# EAGLE design Relay(30A)_sla_12v_slc_v1.0 (EAGLE 9.1.0)
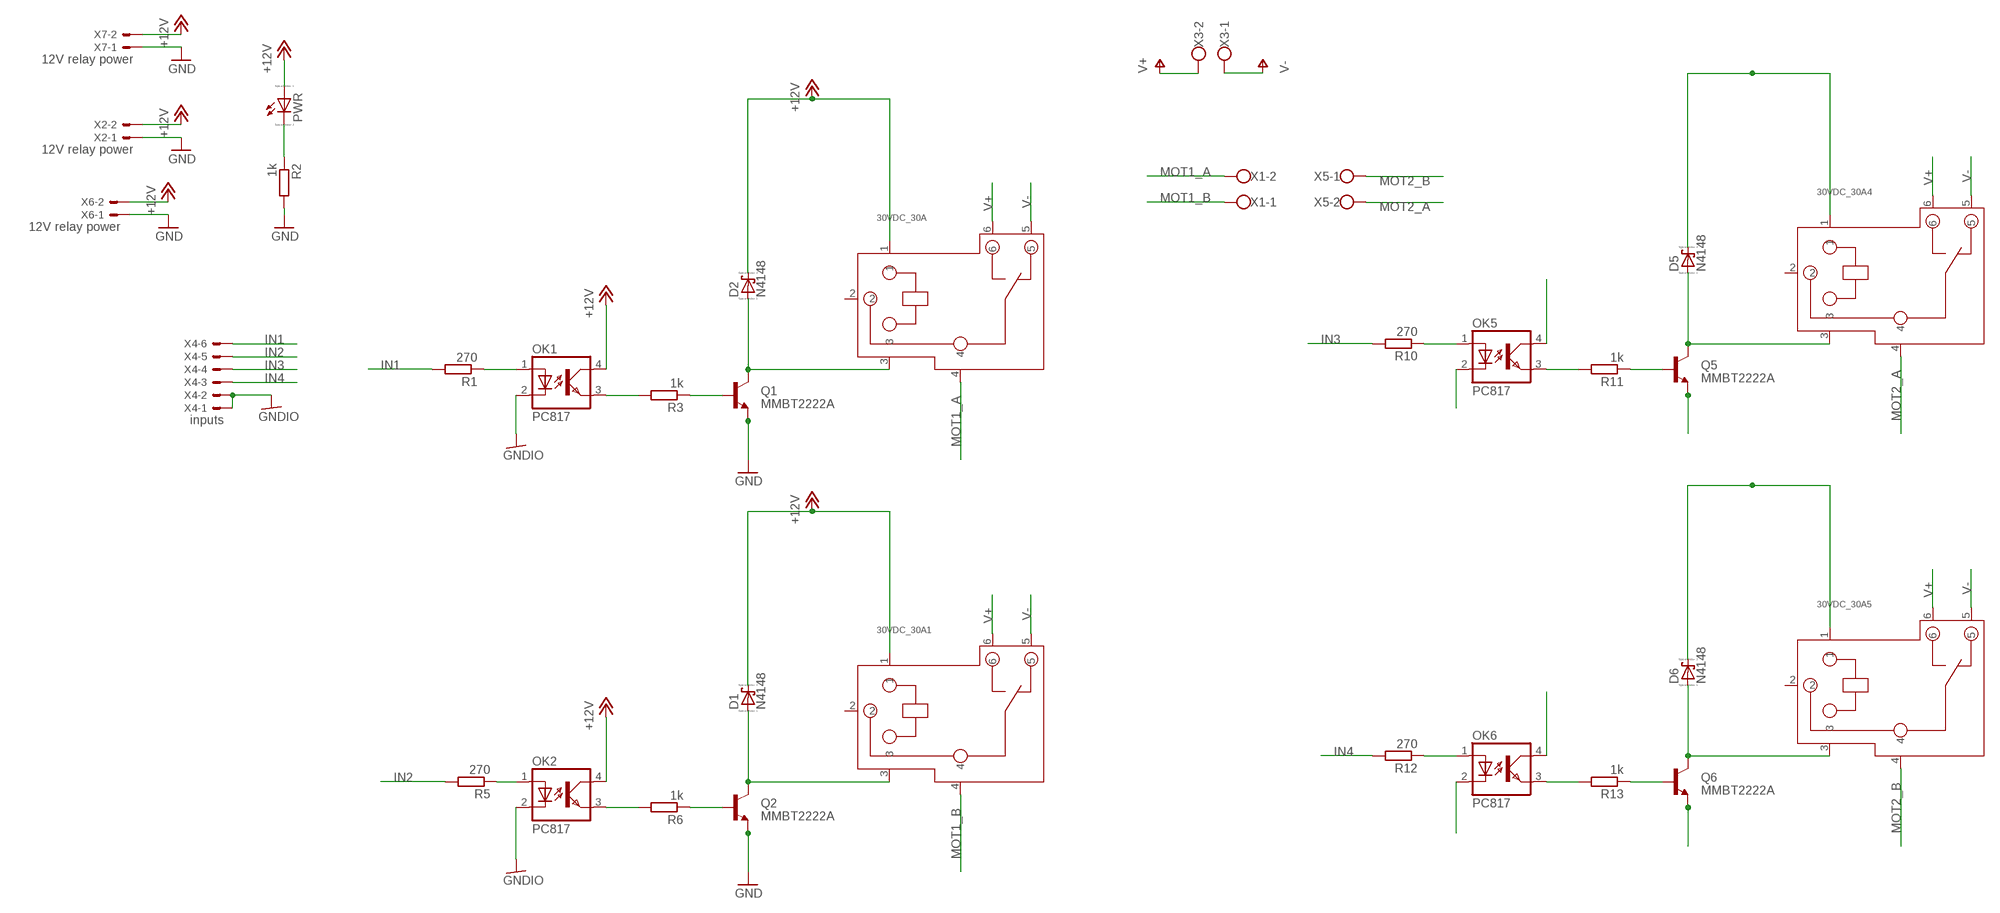
[diagram p0: schematic, sheet 1]

## Parts
30VDC_30A  RELAY-SLA-05VDC-SL-C  [6P-19.8H]
30VDC_30A1  RELAY-SLA-05VDC-SL-C  [6P-19.8H]
30VDC_30A4  RELAY-SLA-05VDC-SL-C  [6P-19.8H]
30VDC_30A5  RELAY-SLA-05VDC-SL-C  [6P-19.8H]
D1  N4148  SCHOTTKY-DIODEF126Z12  [DIODE_F126Z12]
D2  N4148  SCHOTTKY-DIODEF126Z12  [DIODE_F126Z12]
D5  N4148  SCHOTTKY-DIODEF126Z12  [DIODE_F126Z12]
D6  N4148  SCHOTTKY-DIODEF126Z12  [DIODE_F126Z12]
OK1  PC817  [DIL04]
OK2  PC817  [DIL04]
OK5  PC817  [DIL04]
OK6  PC817  [DIL04]
PWR  LED_ELD260  [LED_LD260]
Q1  MMBT2222A  TRANSISTOR_NPNTO92  [TO-92]
Q2  MMBT2222A  TRANSISTOR_NPNTO92  [TO-92]
Q5  MMBT2222A  TRANSISTOR_NPNTO92  [TO-92]
Q6  MMBT2222A  TRANSISTOR_NPNTO92  [TO-92]
R1  270  R-EU_0204/7  [0204/7]
R2  1k  R-EU_0204/5  [0204/5]
R3  1k  R-EU_0204/7  [0204/7]
R5  270  R-EU_0204/5  [0204/5]
R6  1k  R-EU_0204/7  [0204/7]
R10  270  R-EU_0207/10  [0207/10]
R11  1k  R-EU_0204/7  [0204/7]
R12  270  R-EU_0204/5  [0204/5]
R13  1k  R-EU_0204/7  [0204/7]
X1  W237-102  [W237-102]
X2  12V relay power  JST-XH-02-PIN-LONG-PAD  [JST-XH-02-PACKAGE-LONG-PAD]
X3  W237-102  [W237-102]
X4  inputs  JST-XH-06-PIN-LONG-PAD  [JST-XH-06-PACKAGE-LONG-PAD]
X5  W237-102  [W237-102]
X6  12V relay power  JST-XH-02-PIN-LONG-PAD  [JST-XH-02-PACKAGE-LONG-PAD]
X7  12V relay power  JST-XH-02-PIN-LONG-PAD  [JST-XH-02-PACKAGE-LONG-PAD]

## Nets
+12V [500mAmp]: 30VDC_30A1.1 30VDC_30A4.1 30VDC_30A5.1 30VDC_30A.1 D1.C(A) D2.C(A) D5.C(A) D6.C(A) OK1.4(COL) OK2.4(COL) OK5.4(COL) OK6.4(COL) PWR.A X2.2 X6.2 X7.2
GND: Q1.1(E) Q2.1(E) Q5.1(E) Q6.1(E) R2.2 X2.1 X6.1 X7.1
GNDIO: OK1.2(C) OK2.2(C) OK5.2(C) OK6.2(C) X4.1 X4.2
IN1: R1.2 X4.6
IN2: R5.2 X4.5
IN3: R10.2 X4.4
IN4: R12.2 X4.3
MOT1_A [30Amp]: 30VDC_30A.4 X1.2
MOT1_B [30Amp]: 30VDC_30A1.4 X1.1
MOT2_A: 30VDC_30A4.4 X5.2
MOT2_B: 30VDC_30A5.4 X5.1
N$19: OK1.3(EMIT) R3.2
N$20 [500mAmp]: 30VDC_30A1.3 D1.A(C) Q2.3(C)
N$21: PWR.K(C) R2.1
N$22: OK2.3(EMIT) R6.2
N$23 [500mAmp]: 30VDC_30A.3 D2.A(C) Q1.3(C)
N$24: Q1.2(B) R3.1
N$26: Q2.2(B) R6.1
N$27: OK2.1(A) R5.1
N$68: OK1.1(A) R1.1
N$89 [500mAmp]: 30VDC_30A4.3 D5.A(C) Q5.3(C)
N$90 [500mAmp]: 30VDC_30A5.3 D6.A(C) Q6.3(C)
N$91: OK6.1(A) R12.1
N$92: OK5.1(A) R10.1
N$93: OK5.3(EMIT) R11.2
N$94: Q5.2(B) R11.1
N$95: OK6.3(EMIT) R13.2
N$96: Q6.2(B) R13.1
V+ [30Amp]: 30VDC_30A1.6 30VDC_30A4.6 30VDC_30A5.6 30VDC_30A.6 X3.2
V- [30Amp]: 30VDC_30A1.5 30VDC_30A4.5 30VDC_30A5.5 30VDC_30A.5 X3.1
Unconnected: 30VDC_30A1.2 30VDC_30A4.2 30VDC_30A5.2 30VDC_30A.2

## Library data of the parts
30VDC_30A 30VDC_30A1 30VDC_30A4 30VDC_30A5 = Relay(30A)_sla_12v_slc_v1.0:RELAY-SLA-05VDC-SL-C: · Up to 30A switching in SPST and 20A switching in spot arrangements. · Available as an open-frame relay, with a snap-on dust cover or with an immersion cleanable, plastic sealed case.
D1 D2 D5 D6 = Relay(30A)_sla_12v_slc_v1.0:SCHOTTKY-DIODE: Schottky Diode; SPICEMODEL: NONE; SPICEPREFIX: D; SPICETYPE: diode
OK1 OK2 OK5 OK6 = Relay(30A)_sla_12v_slc_v1.0:PC817: SHARP OPTO COUPLER; MPN: PC817X4J000F; OC_FARNELL: 9707727; OC_NEWARK: 97K7059
PWR = Relay(30A)_sla_12v_slc_v1.0:LED_E: LED Source: http://www.osram.convergy.de Source: www.luxeon.com Source: www.kingbright.com; SPICEMODEL: NONE; SPICEPREFIX: D; SPICETYPE: diode
Q1 Q2 Q5 Q6 = Relay(30A)_sla_12v_slc_v1.0:TRANSISTOR_NPN: Generic NPN BJT MMBT2222A - TRANS-08049 (SOT-23, 1A 40V) MPSA42 - TRANS-09116 (SOT-23, 500mA 300V) MMBT5088LT1G - TRANS-11160 (SOT-23, 50 mA 30V) BC547 - COM-08928 <http://www.sparkfun.com/products/8928> (TO-92 45V 100mA) (1.Collector 2.Base 3.Emitter) 2N3904 - COM-00521 <http://www.sparkfun.com/products/521> (TO-92 40V 200mA) (1.Emitter 2.Base 3.Collector) P2N2222A - COM-12852 <http://www.sparkfun.com/products/12852> (TO-92 40V 600mA) (1.Collector 2.Base 3.Emitter)
R1-R3 R5 R6 R10-R13 = Relay(30A)_sla_12v_slc_v1.0:R-EU_: RESISTOR, European symbol; SPICEPREFIX: R
X1 X3 X5 = Relay(30A)_sla_12v_slc_v1.0:W237-102: WAGO SCREW CLAMP; MPN: 237-102; OC_FARNELL: unknown; OC_NEWARK: 70K9898
X2 X6 X7 = Relay(30A)_sla_12v_slc_v1.0:JST-XH-02-PIN: JST XH Connector 2 Pin Wire to board connector. Pitch: 2,54 mm, (0.100") Number of pins: 2 Created by Rembrandt Electronics www.rembrandtelectronics.com
X4 = Relay(30A)_sla_12v_slc_v1.0:JST-XH-06-PIN: JST XH Connector 2 Pin Wire to board connector. Pitch: 2,54 mm, (0.100") Number of pins: 6 Created by Rembrandt Electronics www.rembrandtelectronics.com

## Net classes
0 default: width 0.635 mm
1 30Amp: width 2.54 mm
2 500mAmp: width 0.762 mm

## Board
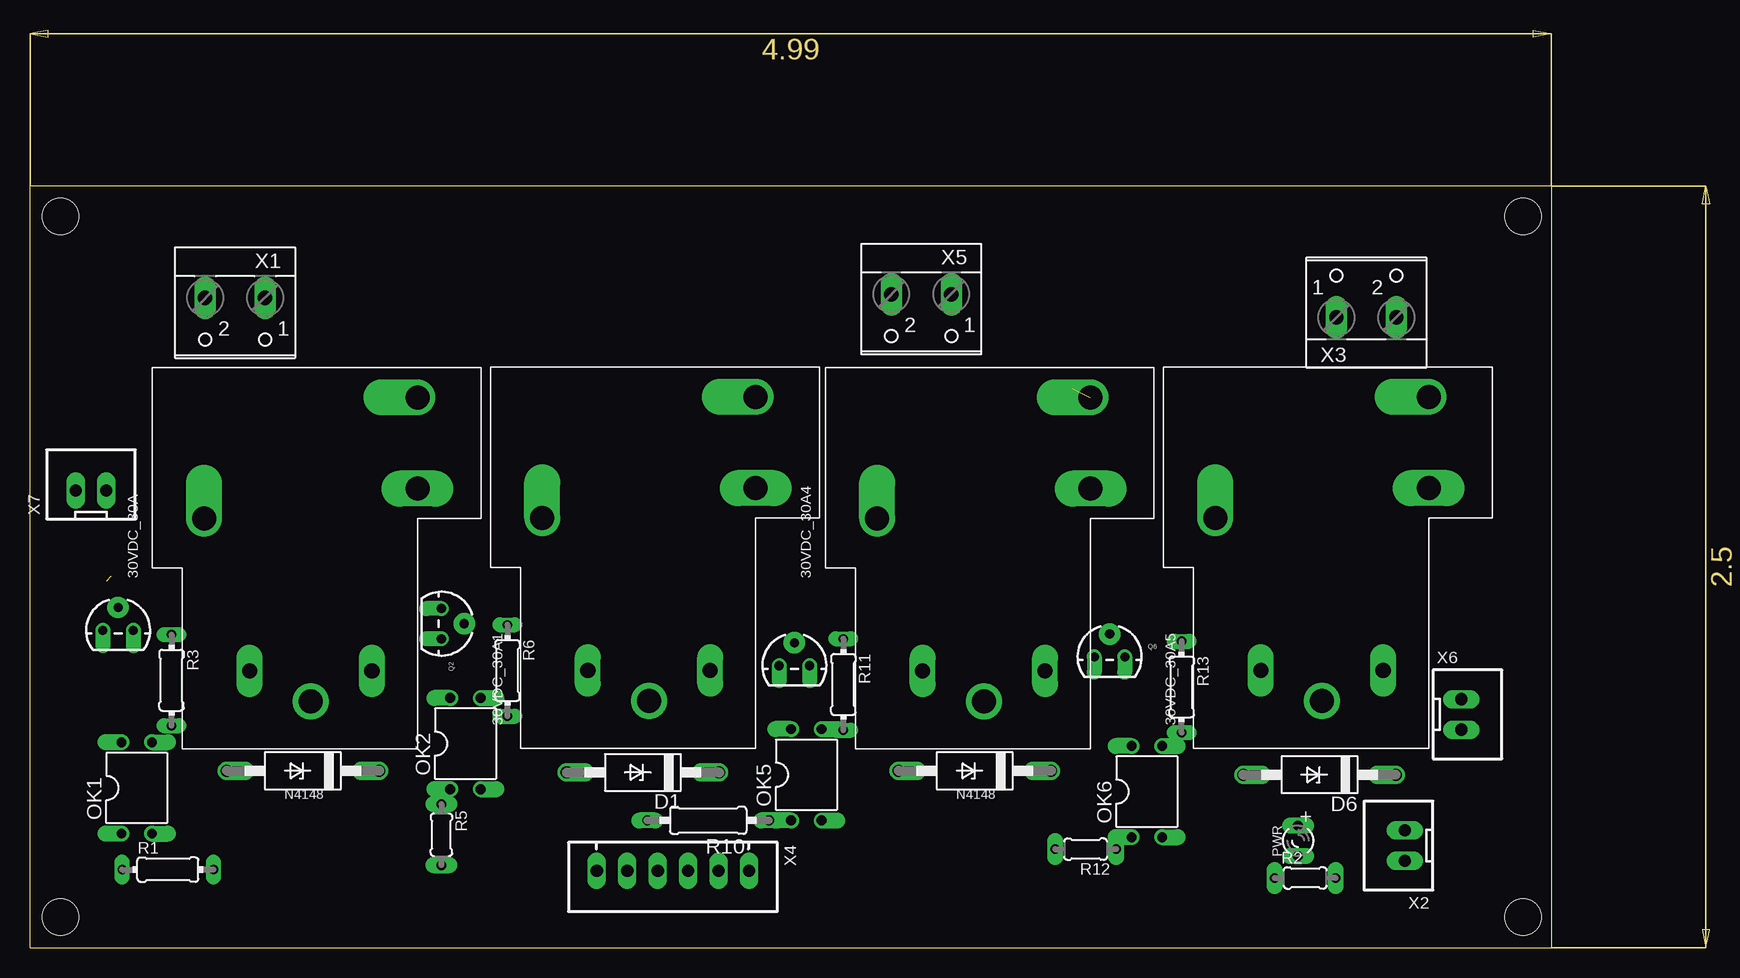
[diagram p1: board, top side]
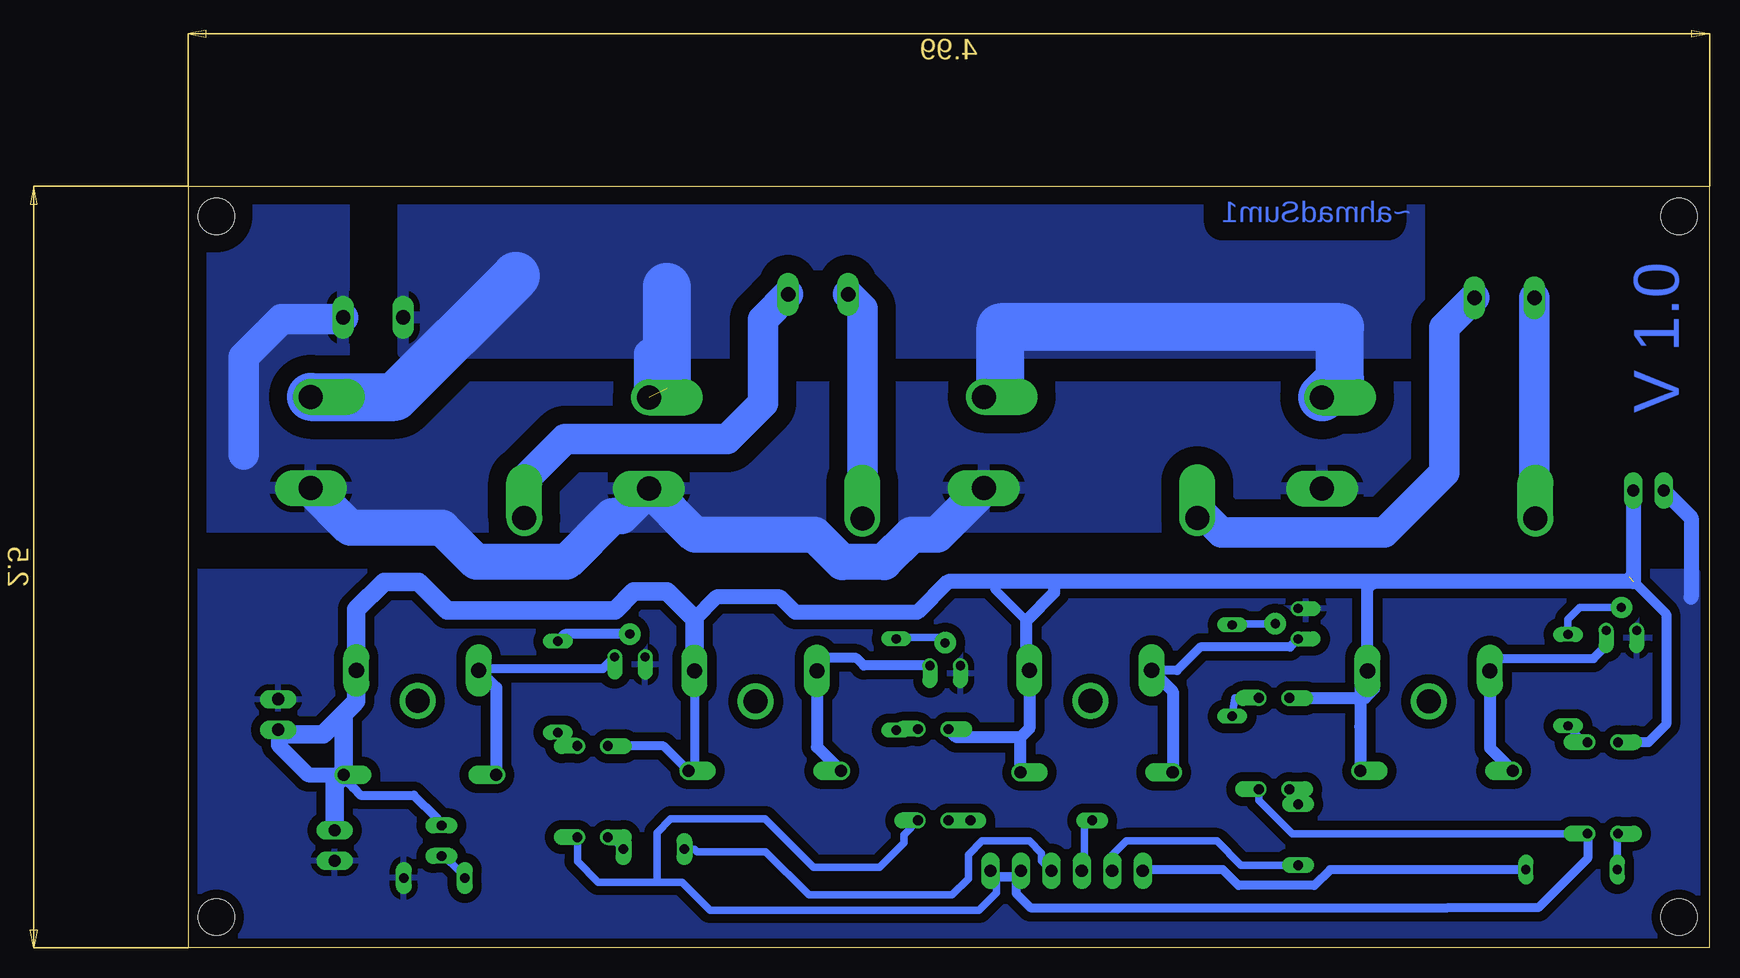
[diagram p2: board, bottom side, seen from below]

Size 126.82 x 63.5 mm. Coordinates in mm from the lower left corner, seen from the top.
Outline: 0,0 126.82,0 126.82,63.5 0,63.5 0,0
Copper layers (1*16): Top 0.035mm / dielectric 1.5mm / Bottom 0.035mm
Design rules "default_25th": minimum track width 25mil, minimum drill 30mil, track to track 25mil, track to pad 25mil, pad to pad 25mil, via to via 25mil, smd to smd 6mil, copper to edge 25mil, drill to drill 30mil, minimum pad ring 10mil, minimum via ring 8mil, stop-mask expansion 4mil, vias tented up to drill 0mil, thermal gap 20mil
Holes 3 mm at 2.54,2.54 124.46,2.54 2.54,60.96 124.46,60.96

### Footprints (pad centres in the part's own frame; a part is rotated, then mirrored left to right if it is on the bottom)
6P-19.8H = drill 1.27 pad 2.184 long: 1 -9.4,-4.6; 3 -9.4,5.6 | drill 2 pad 3: 2 -11.94,0.5 | drill 2 pad 3 offset: 4 3.3,9.4; 5 13.4,-8.4 | drill 2 pad 3 long: 6 5.8,-8.4
DIODE_F126Z12 = drill 1.016 offset: A 6.35,0; C -6.35,0
DIL04 = drill 0.813 offset: 1 -1.27,-3.81; 2 1.27,-3.81; 3 1.27,3.81; 4 -1.27,3.81
LED_LD260 = drill 0.813 long: A -1.27,0; K 1.27,0
TO-92 = drill 0.762 pad 1.27 offset: 1 -1.27,0; 3 1.27,0 | drill 0.762 pad 1.778: 2 0,1.905
0204/7 = drill 0.762 long: 1 -3.81,0; 2 3.81,0
0204/5 = drill 0.813 long: 1 -2.54,0; 2 2.54,0
0207/10 = drill 0.813 long: 1 -5.08,0; 2 5.08,0
W237-102 = drill 1.194 long: 1 -2.5,-1.27; 2 2.5,-1.27
JST-XH-02-PACKAGE-LONG-PAD = drill 1.016 long: 1 -1.27,0; 2 1.27,0
JST-XH-06-PACKAGE-LONG-PAD = drill 1.016 long: 1 -6.35,0; 2 -3.81,0; 3 -1.27,0; 4 1.27,0; 5 3.81,0; 6 6.35,0

### Placement (x,y rotation side)
30VDC_30A  23.91,32.46 90 top
30VDC_30A1  52.1,32.5 90 top
30VDC_30A4  80.01,32.46 90 top
30VDC_30A5  108.2,32.5 90 top
D1  51.1,14.6 180 top
D2  22.76,14.73 180 top
D5  78.76,14.73 180 top
D6  107.5,14.4 180 top
OK1  8.9,13.3 0 top
OK2  36.3,17 0 top
OK5  64.71,14.41 0 top
OK6  93.1,13 0 top
PWR  105.7,8.9 270 top
Q1  7.35,26.44 0 top
Q2  34.3,27 270 top
Q5  63.72,23.5 0 top
Q6  90,24.23 0 top
R1  11.5,6.5 0 top
R2  106.3,5.8 0 top
R3  11.8,22.29 270 top
R5  34.3,9.4 270 top
R6  39.8,23.1 270 top
R10  56.53,10.6 180 top
R11  67.8,21.93 270 top
R12  88,8.2 180 top
R13  96,21.73 270 top
X1  17.1,52.9 180 top
X2  114.6,8.5 90 top
X3  111.4,53.8 0 top
X4  53.6,6.4 180 top
X5  74.3,53.2 180 top
X6  119.3,19.43 270 top
X7  5.08,38.1 0 top

### Tracks (layer width: path | path; a pad name or v marks a point on that pad's centre or on a via)
+12V  (1 unrouted)
  Bottom 0.762: 30VDC_30A4.1 84.61,15.23 D5.C 87.19,16.81 OK6.4 | 59.6,29.9 56.95,27.25 | 28.5,23.07 30VDC_30A.1 | 113.08,13.34 113.72,13.97 D6.C | 114.35,14.61 113.08,13.34 | PWR.A 106.1,10.79 108,12.7 112.45,12.7 113.08,13.34
  Bottom 0.813: 6.73,30.93 3.61,27.81 3.61,18.58 5.09,17.11 OK1.4
  Bottom 1.016: D2.C 29.11,18.41 29.11,22.46 30VDC_30A.1 28.51,29.94 27.94,30.51 | 57.43,17.52 62.75,17.52 OK5.4 | 57.43,17.52 56.7,18.26 30VDC_30A1.1 56.95,23.35 56.95,27.25 54.61,29.59 54.61,30.51 | D1.C 57.45,17.51 57.43,17.52 | OK2.4 28.72,20.81 27.94,21.59 28.5,22.15 28.5,23.07
  Bottom 1.27: D6.C 116.81,14.4 119.3,16.89 X6.2 | X7.2 6.35,30.51 27.94,30.51 54.61,30.51 63.47,30.51 66.04,27.94 76.2,27.94 77.47,29.21 82.81,29.21 84.61,27.41
  Bottom 1.524: 113.03,20.32 112.8,20.55 30VDC_30A5.1 112.8,28.17 110.49,30.48 107.59,30.48 105.23,28.12 91.24,28.12 89.67,29.69 86.89,29.69 84.61,27.41 30VDC_30A4.1 | 113.03,20.32 115.57,17.78 118.92,17.78 X6.2 | X2.2 114.6,13.65 D6.C 113.85,19.5 113.03,20.32
GND
  Bottom 1.27: 1.52,29.21 1.52,35.81 X7.1
  pour Bottom (isolate 0.762): 1,31.3 130.9,31.3 130.9,-3.1 1,-3.1
GNDIO
  Bottom 0.635: OK1.2 34.79,9.49 37.57,12.27 OK2.2 | OK6.2 94.37,7.19 92.63,5.45 88.32,5.45 | 57.81,6 X4.2 57.41,6 57.51,5.9 | X4.1 59.45,5.9 59.45,4.55 60.88,3.12 83.31,3.12 85.65,5.45 88.32,5.45 | 88.32,5.45 87.73,5.45 87.73,9.57 86.58,10.71 78.71,10.71 74.7,6.7 69.2,6.7 67.17,8.73 67.17,9.41 OK5.2
  Bottom 0.762: 57.81,6 57.81,4.52 56.61,3.32 21.8,3.32 14.27,3.32 10.17,7.43 OK1.2
  Bottom 0.8: 59.45,5.9 57.51,5.9
IN1
  Bottom 0.762: X4.6 47.15,6.5 40.58,6.5 39.27,5.18 32.94,5.18 31.62,6.5 R1.2
IN2
  Bottom 0.635: R5.2 39.06,6.86 41.07,8.88 48.62,8.88 49.79,7.71 X4.5
IN3
  Bottom 0.635: R10.2 52.12,10.23 52.12,6.99 X4.4
IN4
  Bottom 0.635: X4.3 55.69,7.23 55.69,7.87 56.7,8.88 60.66,8.88 61.78,7.75 61.78,5.73 63.13,4.39 75.08,4.39 78.7,8 84.4,8 84.6,8.2 R12.2
MOT1_A
  Bottom 2.54: X1.2 14.6,35.85 30VDC_30A.4
MOT1_B
  Bottom 2.54: 30VDC_30A1.4 42.7,36 42.4,36.3 40.7,34.6 27.1,34.6 22.1,39.6 22.1,51.67 X1.1
MOT2_A
  Bottom 2.54: 30VDC_30A4.4 70.61,53.28 X5.2
MOT2_B
  Bottom 2.54: X5.1 78.9,52.37 78.9,45.4 81.9,42.4 95.4,42.4 98.8,39 30VDC_30A5.4
N$19
  Bottom 0.635: R3.2 10.43,17.11 OK1.3
N$20
  Bottom 0.762: 30VDC_30A1.3 44.39,23.1 42.44,25.05 34.98,25.05 Q2.3
  Bottom 1.016: D1.A 44.75,21.35 30VDC_30A1.3
N$21
  Bottom 0.635: R2.1 104.19,6.35 105.46,7.62 PWR.K
N$22
  Bottom 0.635: OK2.3 39.55,20.81 R6.2
N$23
  Bottom 0.762: 30VDC_30A.3 18.31,23.79 17.99,24.1 9.69,24.1 8.62,25.17 Q1.3
  Bottom 1.016: 30VDC_30A.3 18.31,16.63 D2.A
N$24
  Bottom 0.635: Q1.2 10.82,28.35 11.8,27.37 R3.1
N$26
  Bottom 0.635: Q2.2 39.71,27 R6.1
N$27
  Bottom 0.635: OK2.1 34.3,12.46 R5.1
N$68
  Bottom 0.635: R1.1 7.67,6.99 7.67,8.89 OK1.1
N$89
  Bottom 0.813: Q5.3 70.49,23.5 71.12,24.13 74.93,24.13 74.93,23.59 30VDC_30A4.3
  Bottom 1.016: 30VDC_30A4.3 74.41,16.73 D5.A
N$90
  Bottom 0.762: 30VDC_30A5.3 102.6,23.23 92.27,23.23 Q6.3
  Bottom 1.016: D6.A 101.15,21.65 30VDC_30A5.3
N$91
  Bottom 0.635: OK6.1 91.53,9.19 R12.1
N$92
  Bottom 0.635: R10.1 OK5.1
N$93
  Bottom 0.635: R11.2 67.76,18.08 67.62,18.22 OK5.3
N$94
  Bottom 0.635: Q5.2 63.72,25.86 67.76,25.86 67.79,25.83 R11.1
N$95
  Bottom 0.635: R13.2 94.89,16.81 OK6.3
N$96
  Bottom 0.813: Q6.2 95.4,26.14 R13.1
V+
  Bottom 2.54: X3.2 114.02,52.41 119.01,52.41 122.2,49.22 122.2,41.1
  Bottom 3: 30VDC_30A5.6 113.3,35 105.64,35 102.8,32.16 95.29,32.16 91.49,35.96 90.71,35.96 30VDC_30A4.6 84.54,34.4 74.58,34.4 72.31,32.13 68.8,32.13 66.53,34.4 64.4,34.4 30VDC_30A1.6
  pour Bottom (isolate 1.5): 24.1,35.1 24.1,42 24.1,46.7 113.8,46.7 113.8,62.3 141.6,62.3 141.6,35.1
V-  (1 unrouted)
  Bottom 2.54: 30VDC_30A1.5 59.1,45.9 59.1,46.6 | 30VDC_30A4.5 88.41,49.46
  Bottom 4: 30VDC_30A5.5 109.6,45.9 99.5,56 | 86.91,46.6 86.91,55.1 | 30VDC_30A.5 30.81,47.36 30.81,51.71 59.1,51.71 59.1,46.6
  pour Bottom (isolate 1.5): 24.2,64.8 108.9,64.8 108.9,49.6 24.3,49.6 24.2,49.6

### Text on the board
Bottom: ~ahmadSum1 | V 1.0